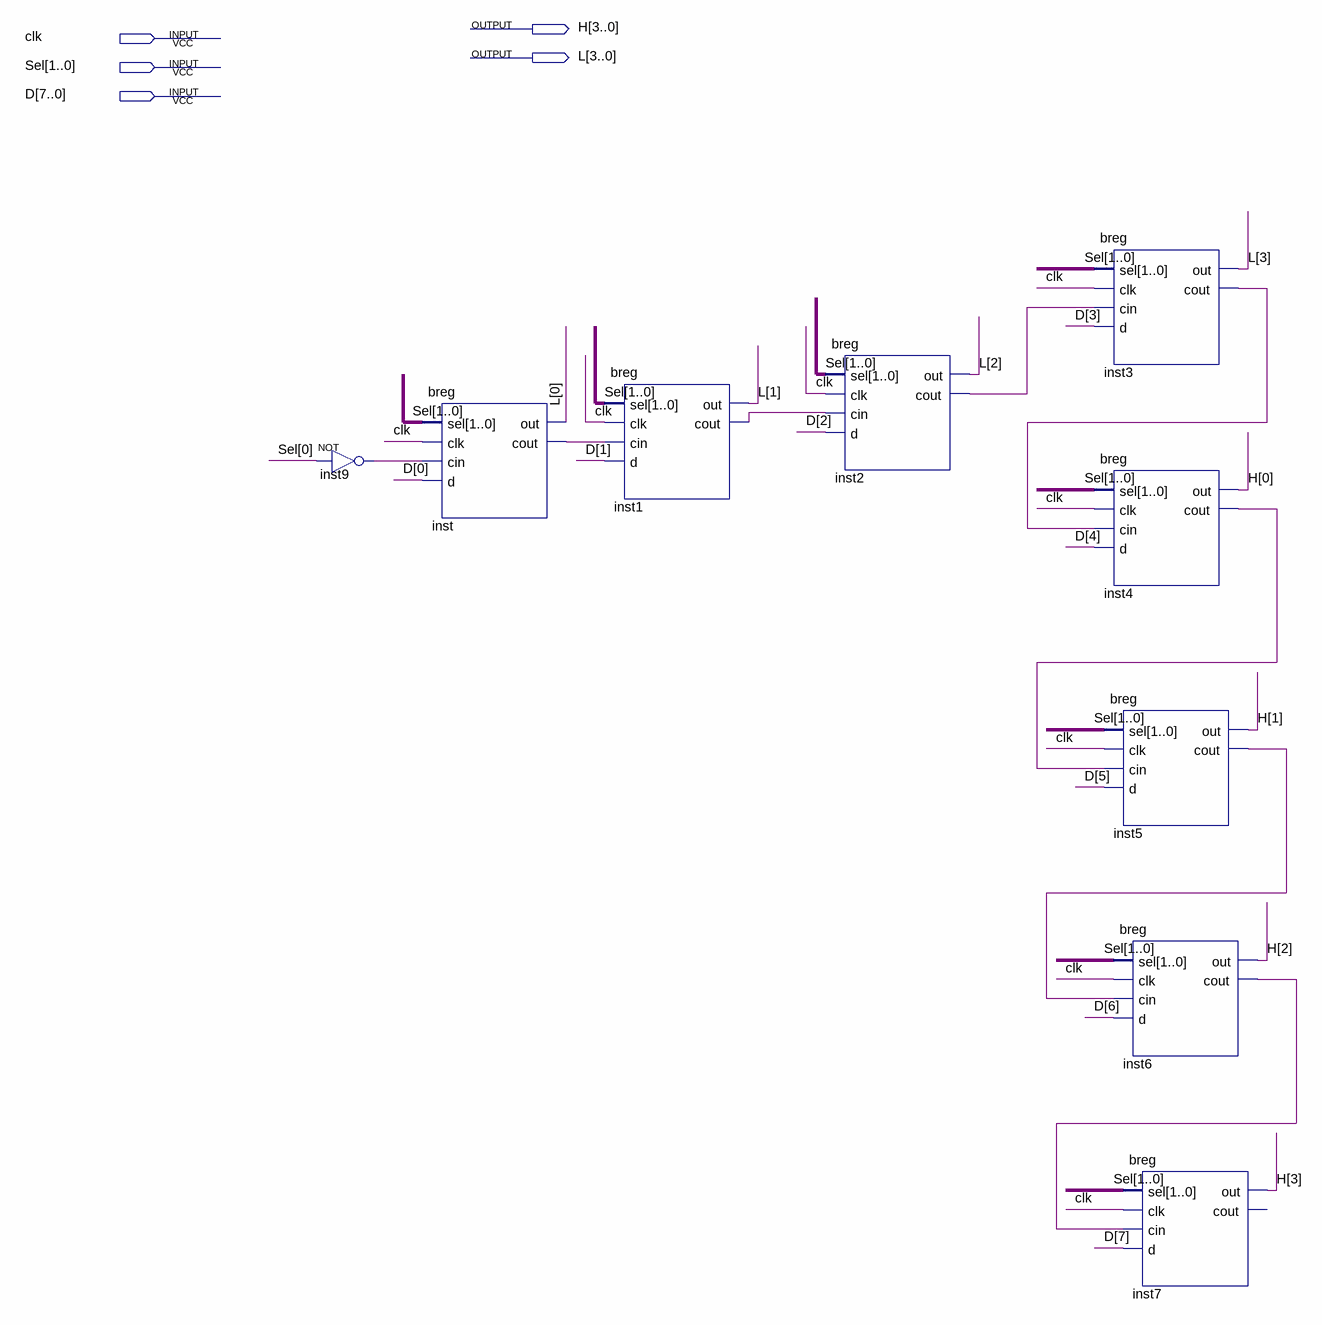
[diagram p0: schematic sheet]
// Quartus schematic oreg.bdf as structural Verilog: 9 symbols, 5 pins
module oreg (
  input  clk,
  input  [1:0] Sel,
  input  [7:0] D,
  output [3:0] H,
  output [3:0] L
);

  wire inst1_cout, inst2_cout, inst3_cout, inst4_cout, inst5_cout, inst6_cout, inst9_out, inst_cout;

  not inst9 (inst9_out, Sel[0]);
  breg inst (.sel(Sel), .clk(clk), .cin(inst9_out), .d(D[0]), .out(L[0]), .cout(inst_cout));
  breg inst1 (.sel(Sel), .clk(clk), .cin(inst_cout), .d(D[1]), .out(L[1]), .cout(inst1_cout));
  breg inst2 (.sel(Sel), .clk(clk), .cin(inst1_cout), .d(D[2]), .out(L[2]), .cout(inst2_cout));
  breg inst3 (.sel(Sel), .clk(clk), .cin(inst2_cout), .d(D[3]), .out(L[3]), .cout(inst3_cout));
  breg inst4 (.sel(Sel), .clk(clk), .cin(inst3_cout), .d(D[4]), .out(H[0]), .cout(inst4_cout));
  breg inst5 (.sel(Sel), .clk(clk), .cin(inst4_cout), .d(D[5]), .out(H[1]), .cout(inst5_cout));
  breg inst6 (.sel(Sel), .clk(clk), .cin(inst5_cout), .d(D[6]), .out(H[2]), .cout(inst6_cout));
  breg inst7 (.sel(Sel), .clk(clk), .cin(inst6_cout), .d(D[7]), .out(H[3]));  // open: cout
endmodule
